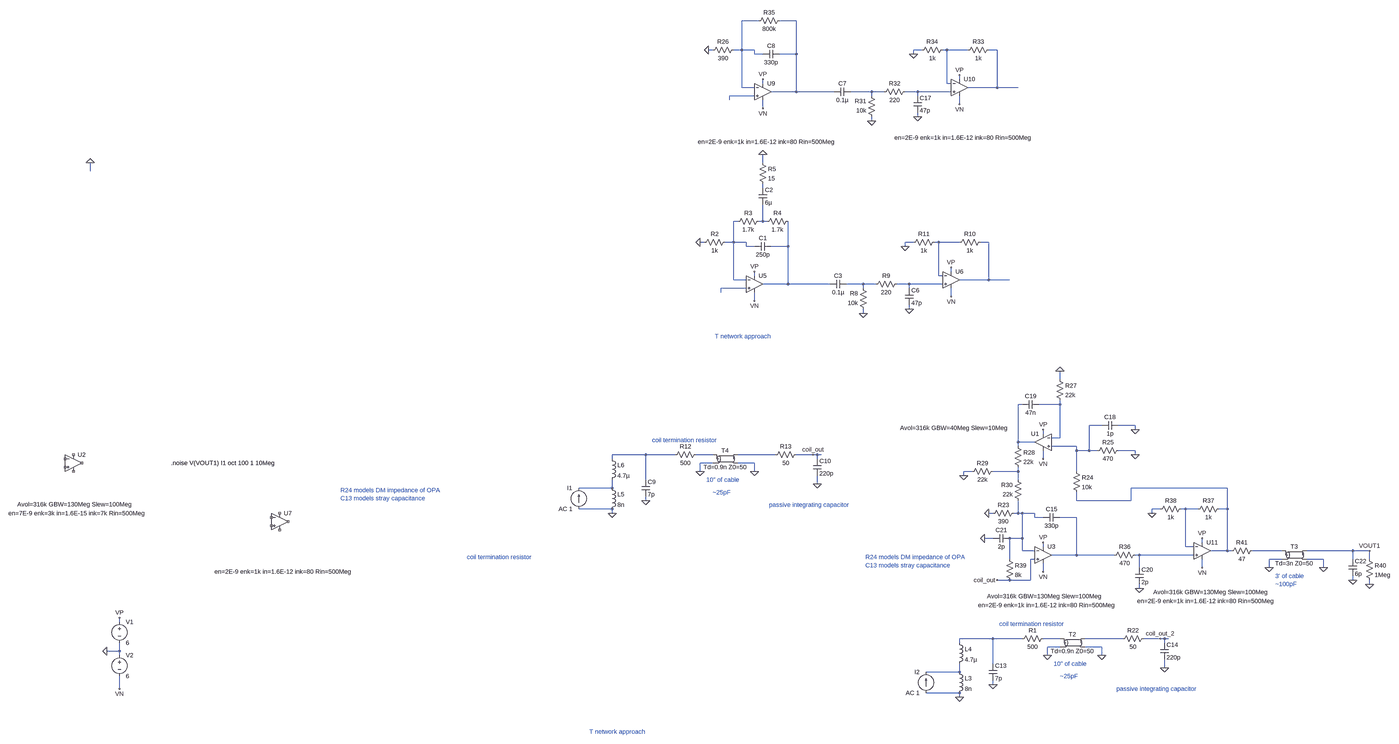
[diagram p0: schematic noise_sim.asc, whole sheet]
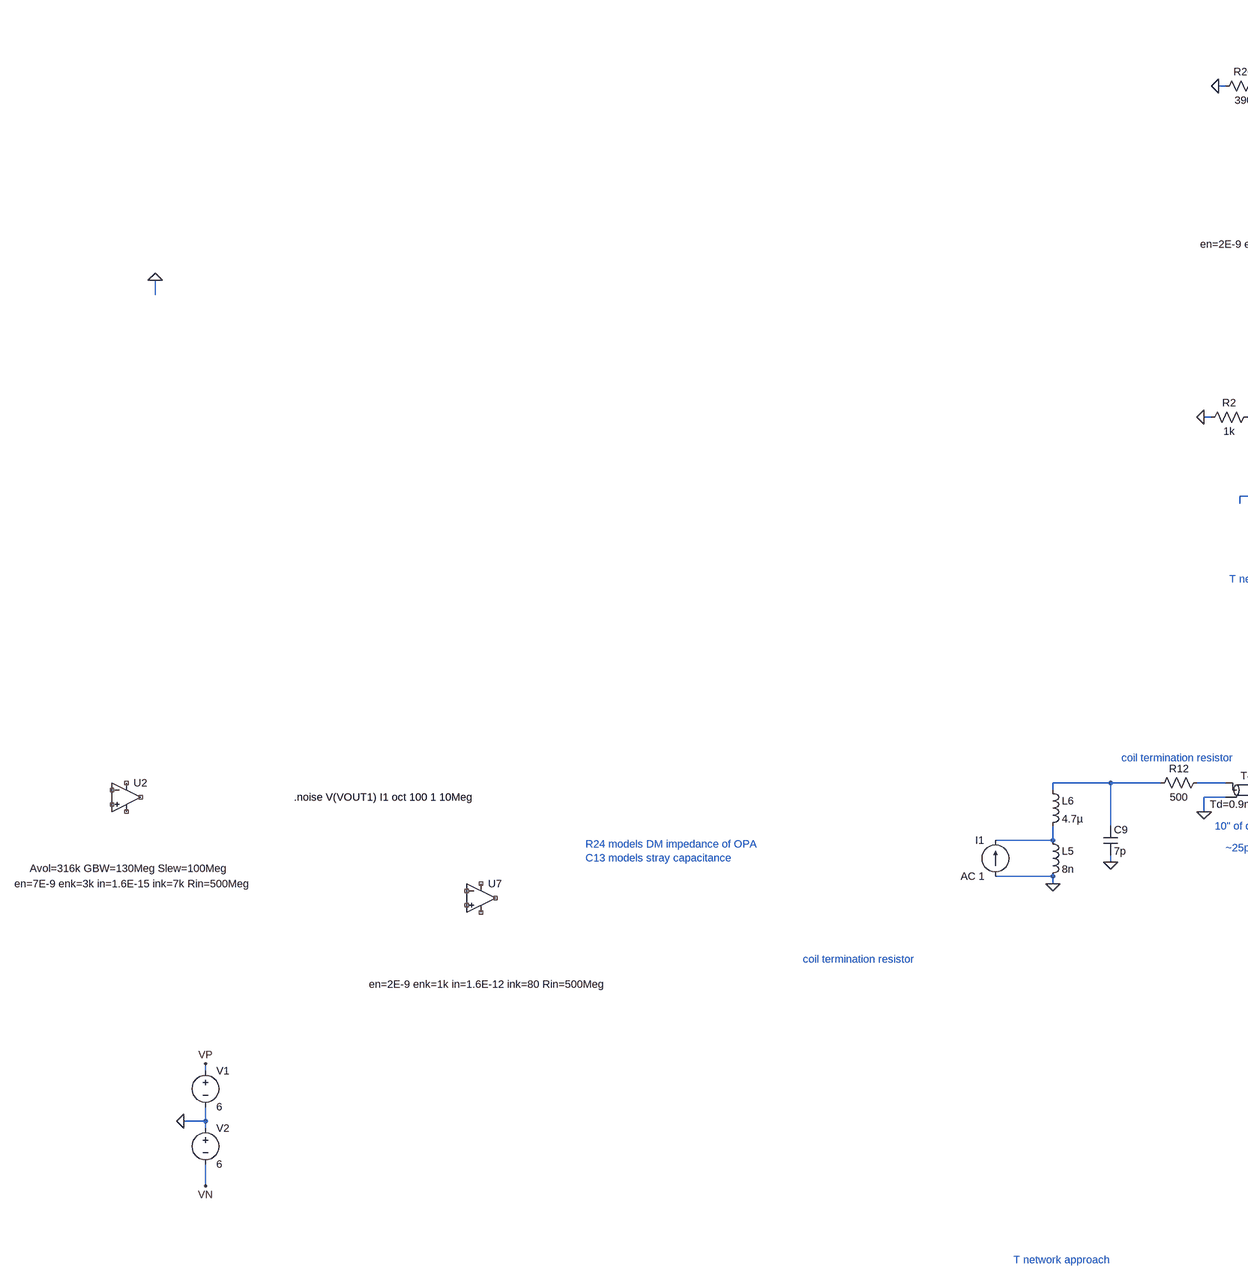
[diagram p1: schematic noise_sim.asc, part, row 1 of 1, column 1 of 2]
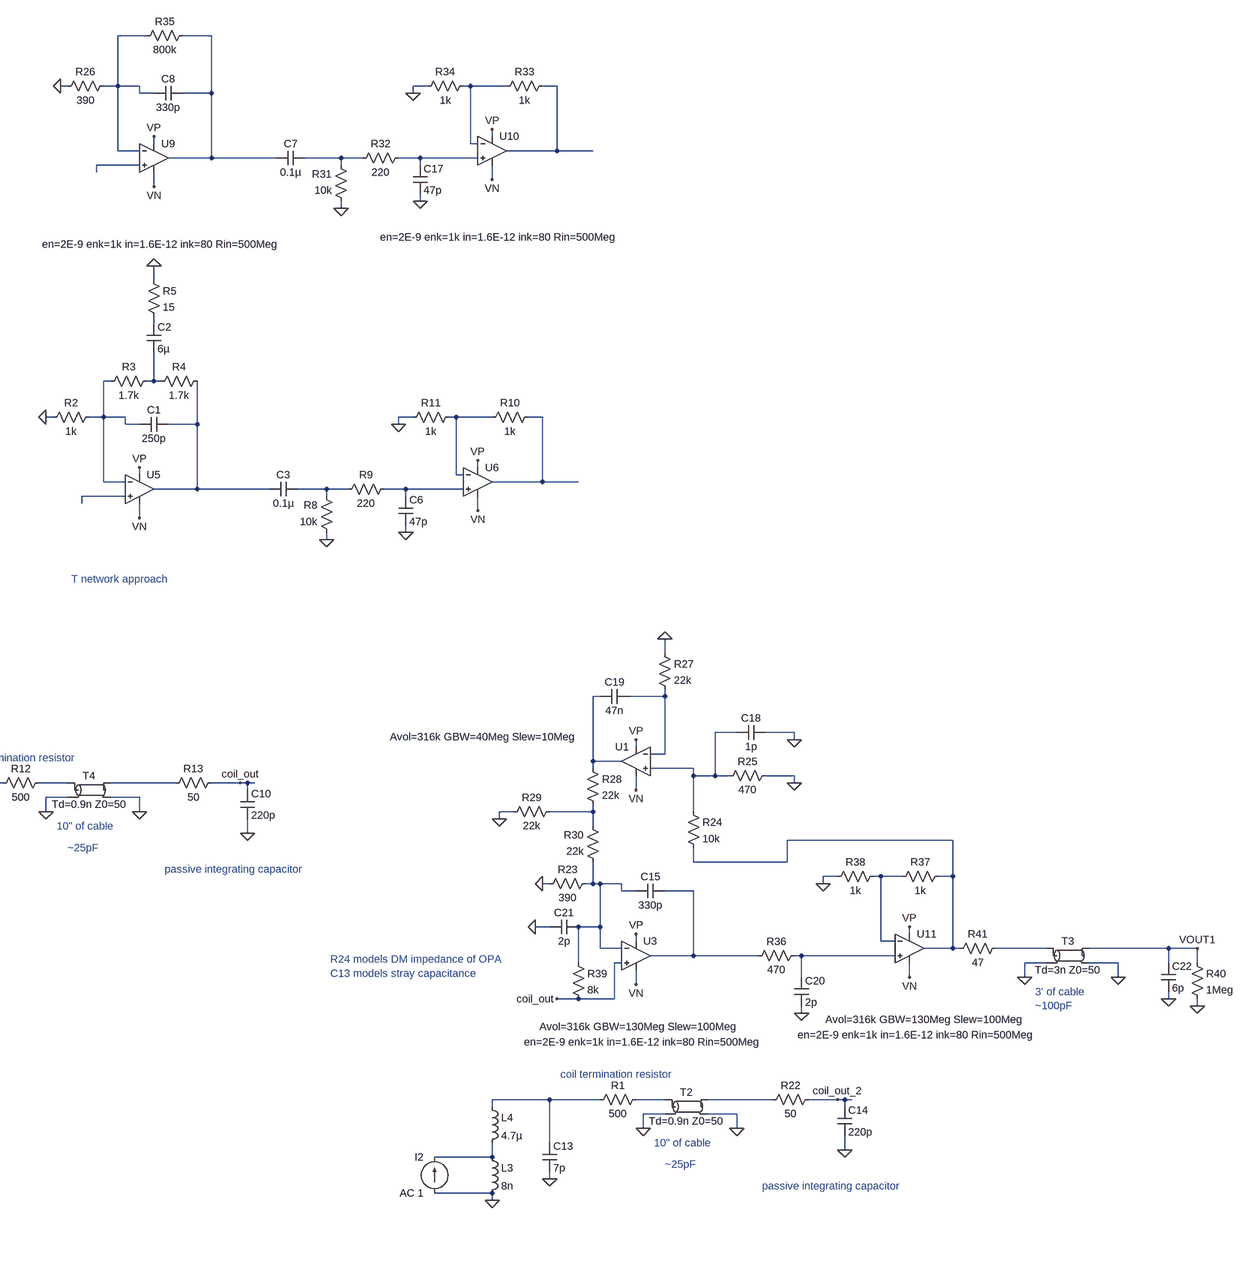
[diagram p2: schematic noise_sim.asc, part, row 1 of 1, column 2 of 2]
noise_sim.asc, the LTspice schematic file:
Version 4
SHEET 1 3200 680
WIRE 768 -3056 704 -3056
WIRE 912 -3056 848 -3056
WIRE 592 -2944 576 -2944
WIRE 704 -2944 704 -3056
WIRE 704 -2944 672 -2944
WIRE 752 -2944 704 -2944
WIRE 1392 -2944 1360 -2944
WIRE 1488 -2944 1472 -2944
WIRE 1568 -2944 1488 -2944
WIRE 1680 -2944 1648 -2944
WIRE 752 -2928 752 -2944
WIRE 784 -2928 752 -2928
WIRE 912 -2928 912 -3056
WIRE 912 -2928 848 -2928
WIRE 1360 -2928 1360 -2944
WIRE 1536 -2832 1536 -2848
WIRE 784 -2816 784 -2832
WIRE 1488 -2816 1488 -2944
WIRE 1504 -2816 1488 -2816
WIRE 704 -2800 704 -2944
WIRE 752 -2800 704 -2800
WIRE 1680 -2800 1680 -2944
WIRE 1680 -2800 1568 -2800
WIRE 1760 -2800 1680 -2800
WIRE 912 -2784 912 -2928
WIRE 912 -2784 816 -2784
WIRE 1056 -2784 912 -2784
WIRE 1200 -2784 1120 -2784
WIRE 1248 -2784 1200 -2784
WIRE 1376 -2784 1328 -2784
WIRE 1504 -2784 1376 -2784
WIRE 752 -2768 656 -2768
WIRE 1200 -2768 1200 -2784
WIRE 1376 -2768 1376 -2784
WIRE 656 -2752 656 -2768
WIRE 1536 -2736 1536 -2768
WIRE 784 -2720 784 -2752
WIRE 1376 -2688 1376 -2704
WIRE 1200 -2672 1200 -2688
WIRE 784 -2512 784 -2544
WIRE -2000 -2480 -2000 -2512
WIRE 784 -2416 784 -2432
WIRE 688 -2288 672 -2288
WIRE 784 -2288 784 -2352
WIRE 784 -2288 768 -2288
WIRE 800 -2288 784 -2288
WIRE 560 -2208 544 -2208
WIRE 672 -2208 672 -2288
WIRE 672 -2208 640 -2208
WIRE 720 -2208 672 -2208
WIRE 1360 -2208 1328 -2208
WIRE 1456 -2208 1440 -2208
WIRE 1536 -2208 1456 -2208
WIRE 1648 -2208 1616 -2208
WIRE 720 -2192 720 -2208
WIRE 752 -2192 720 -2192
WIRE 880 -2192 880 -2288
WIRE 880 -2192 816 -2192
WIRE 1328 -2192 1328 -2208
WIRE 1504 -2096 1504 -2112
WIRE 752 -2080 752 -2096
WIRE 1456 -2080 1456 -2208
WIRE 1472 -2080 1456 -2080
WIRE 672 -2064 672 -2208
WIRE 720 -2064 672 -2064
WIRE 1648 -2064 1648 -2208
WIRE 1648 -2064 1536 -2064
WIRE 1728 -2064 1648 -2064
WIRE 880 -2048 880 -2192
WIRE 880 -2048 784 -2048
WIRE 1040 -2048 880 -2048
WIRE 1168 -2048 1104 -2048
WIRE 1216 -2048 1168 -2048
WIRE 1344 -2048 1296 -2048
WIRE 1472 -2048 1344 -2048
WIRE 720 -2032 624 -2032
WIRE 1168 -2032 1168 -2048
WIRE 1344 -2032 1344 -2048
WIRE 624 -2016 624 -2032
WIRE 1504 -2000 1504 -2032
WIRE 752 -1984 752 -2016
WIRE 1344 -1952 1344 -1968
WIRE 1168 -1936 1168 -1952
WIRE 1920 -1408 1920 -1440
WIRE 1776 -1312 1760 -1312
WIRE 1920 -1312 1920 -1328
WIRE 1920 -1312 1840 -1312
WIRE 2080 -1232 2032 -1232
WIRE 2208 -1232 2144 -1232
WIRE 2208 -1216 2208 -1232
WIRE 1856 -1200 1856 -1216
WIRE 1920 -1184 1920 -1312
WIRE 1920 -1184 1888 -1184
WIRE 1760 -1168 1760 -1312
WIRE 1824 -1168 1760 -1168
WIRE 1760 -1152 1760 -1168
WIRE 1984 -1152 1888 -1152
WIRE 1984 -1136 1984 -1152
WIRE 2032 -1136 2032 -1232
WIRE 2032 -1136 1984 -1136
WIRE 2064 -1136 2032 -1136
WIRE 2208 -1136 2144 -1136
WIRE 336 -1120 208 -1120
WIRE 448 -1120 336 -1120
WIRE 592 -1120 528 -1120
WIRE 832 -1120 688 -1120
WIRE 976 -1120 912 -1120
WIRE 992 -1120 976 -1120
WIRE 1008 -1120 992 -1120
WIRE 2208 -1120 2208 -1136
WIRE 208 -1104 208 -1120
WIRE 992 -1104 992 -1120
WIRE 1856 -1104 1856 -1136
WIRE 592 -1088 544 -1088
WIRE 752 -1088 688 -1088
WIRE 544 -1056 544 -1088
WIRE 752 -1056 752 -1088
WIRE 1584 -1056 1552 -1056
WIRE 1760 -1056 1760 -1072
WIRE 1760 -1056 1664 -1056
WIRE 1984 -1056 1984 -1136
WIRE 1552 -1040 1552 -1056
WIRE 336 -1024 336 -1120
WIRE 1760 -1024 1760 -1056
WIRE 992 -1008 992 -1040
WIRE 208 -992 208 -1024
WIRE 208 -992 80 -992
WIRE 2560 -992 2192 -992
WIRE 336 -944 336 -960
WIRE 1984 -944 1984 -976
WIRE 2192 -944 2192 -992
WIRE 2192 -944 1984 -944
WIRE 208 -912 80 -912
WIRE 2304 -912 2272 -912
WIRE 2400 -912 2384 -912
WIRE 2448 -912 2400 -912
WIRE 2560 -912 2560 -992
WIRE 2560 -912 2528 -912
WIRE 208 -896 208 -912
WIRE 1664 -896 1648 -896
WIRE 1760 -896 1760 -944
WIRE 1760 -896 1744 -896
WIRE 1776 -896 1760 -896
WIRE 1824 -896 1776 -896
WIRE 2272 -896 2272 -912
WIRE 1824 -880 1824 -896
WIRE 1856 -880 1824 -880
WIRE 1984 -880 1920 -880
WIRE 1664 -800 1632 -800
WIRE 1776 -800 1776 -896
WIRE 1776 -800 1728 -800
WIRE 2464 -784 2464 -800
WIRE 1856 -768 1856 -784
WIRE 2400 -768 2400 -912
WIRE 2432 -768 2400 -768
WIRE 1776 -752 1776 -800
WIRE 1824 -752 1776 -752
WIRE 2560 -752 2560 -912
WIRE 2560 -752 2496 -752
WIRE 2576 -752 2560 -752
WIRE 2768 -752 2656 -752
WIRE 3040 -752 2864 -752
WIRE 3104 -752 3040 -752
WIRE 1984 -736 1984 -880
WIRE 1984 -736 1888 -736
WIRE 2128 -736 1984 -736
WIRE 2224 -736 2208 -736
WIRE 2432 -736 2224 -736
WIRE 1728 -720 1728 -800
WIRE 1824 -720 1808 -720
WIRE 2768 -720 2720 -720
WIRE 2928 -720 2864 -720
WIRE 3040 -720 3040 -752
WIRE 3104 -720 3104 -752
WIRE 2224 -688 2224 -736
WIRE 2464 -688 2464 -720
WIRE 2720 -688 2720 -720
WIRE 2928 -688 2928 -720
WIRE 1856 -672 1856 -704
WIRE 1728 -640 1680 -640
WIRE 1808 -640 1808 -720
WIRE 1808 -640 1728 -640
WIRE 3040 -640 3040 -656
WIRE 3104 -624 3104 -640
WIRE 2224 -608 2224 -624
WIRE -1888 -480 -1888 -496
WIRE 1664 -416 1536 -416
WIRE 1776 -416 1664 -416
WIRE 1920 -416 1856 -416
WIRE 2160 -416 2016 -416
WIRE 2304 -416 2240 -416
WIRE 2320 -416 2304 -416
WIRE 2336 -416 2320 -416
WIRE 1536 -400 1536 -416
WIRE 2320 -400 2320 -416
WIRE 1920 -384 1872 -384
WIRE 2080 -384 2016 -384
WIRE -1888 -368 -1888 -400
WIRE -1888 -368 -1936 -368
WIRE -1888 -352 -1888 -368
WIRE 1872 -352 1872 -384
WIRE 2080 -352 2080 -384
WIRE 1664 -320 1664 -416
WIRE 2320 -304 2320 -336
WIRE 1536 -288 1536 -320
WIRE 1536 -288 1408 -288
WIRE 1664 -240 1664 -256
WIRE -1888 -224 -1888 -272
WIRE 1536 -208 1408 -208
WIRE 1536 -192 1536 -208
FLAG -1936 -368 0
FLAG -1888 -496 VP
FLAG -1888 -224 VN
FLAG -2000 -2512 0
FLAG 752 -2096 VP
FLAG 752 -1984 VN
FLAG 544 -2208 0
FLAG 784 -2544 0
FLAG 1344 -1952 0
FLAG 1168 -1936 0
FLAG 1504 -2112 VP
FLAG 1504 -2000 VN
FLAG 1328 -2192 0
FLAG 784 -2832 VP
FLAG 784 -2720 VN
FLAG 576 -2944 0
FLAG 1376 -2688 0
FLAG 1200 -2672 0
FLAG 1536 -2848 VP
FLAG 1536 -2736 VN
FLAG 1360 -2928 0
FLAG 1680 -640 coil_out
FLAG 1664 -240 0
FLAG 1536 -192 0
FLAG 1872 -352 0
FLAG 2080 -352 0
FLAG 2320 -304 0
FLAG 2304 -416 coil_out_2
FLAG 1856 -784 VP
FLAG 1856 -672 VN
FLAG 1648 -896 0
FLAG 1856 -1216 VP
FLAG 1856 -1104 VN
FLAG 2208 -1120 0
FLAG 2208 -1216 0
FLAG 1920 -1440 0
FLAG 1552 -1040 0
FLAG 2464 -800 VP
FLAG 2464 -688 VN
FLAG 2224 -608 0
FLAG 2272 -896 0
FLAG 1632 -800 0
FLAG 2720 -688 0
FLAG 2928 -688 0
FLAG 3040 -640 0
FLAG 3104 -624 0
FLAG 3104 -752 VOUT1
FLAG 336 -944 0
FLAG 208 -896 0
FLAG 544 -1056 0
FLAG 752 -1056 0
FLAG 992 -1008 0
FLAG 976 -1120 coil_out
SYMBOL voltage -1888 -496 R0
WINDOW 123 0 0 Left 0
WINDOW 39 0 0 Left 0
SYMATTR InstName V1
SYMATTR Value 6
SYMBOL voltage -1888 -368 R0
WINDOW 123 0 0 Left 0
WINDOW 39 0 0 Left 0
SYMATTR InstName V2
SYMATTR Value 6
SYMBOL res 544 -2192 R270
WINDOW 0 32 56 VTop 2
WINDOW 3 0 56 VBottom 2
SYMATTR InstName R2
SYMATTR Value 1k
SYMBOL cap 816 -2208 R90
WINDOW 0 0 32 VBottom 2
WINDOW 3 32 32 VTop 2
SYMATTR InstName C1
SYMATTR Value 250p
SYMBOL res 784 -2304 R90
WINDOW 0 0 56 VBottom 2
WINDOW 3 32 56 VTop 2
SYMATTR InstName R3
SYMATTR Value 1.7k
SYMBOL res 896 -2304 R90
WINDOW 0 0 56 VBottom 2
WINDOW 3 32 56 VTop 2
SYMATTR InstName R4
SYMATTR Value 1.7k
SYMBOL cap 768 -2416 R0
SYMATTR InstName C2
SYMATTR Value 6µ
SYMBOL res 768 -2528 R0
SYMATTR InstName R5
SYMATTR Value 15
SYMBOL res 1184 -1936 R180
WINDOW 0 36 76 Left 2
WINDOW 3 36 40 Left 2
SYMATTR InstName R8
SYMATTR Value 10k
SYMBOL cap 1104 -2064 R90
WINDOW 0 0 32 VBottom 2
WINDOW 3 32 32 VTop 2
SYMATTR InstName C3
SYMATTR Value 0.1µ
SYMBOL res 1312 -2064 R90
WINDOW 0 0 56 VBottom 2
WINDOW 3 32 56 VTop 2
SYMATTR InstName R9
SYMATTR Value 220
SYMBOL cap 1328 -2032 R0
SYMATTR InstName C6
SYMATTR Value 47p
SYMBOL res 1632 -2224 R90
WINDOW 0 0 56 VBottom 2
WINDOW 3 32 56 VTop 2
SYMATTR InstName R10
SYMATTR Value 1k
SYMBOL res 1456 -2224 R90
WINDOW 0 0 56 VBottom 2
WINDOW 3 32 56 VTop 2
SYMATTR InstName R11
SYMATTR Value 1k
SYMBOL OpAmps\\UniversalOpamp2 752 -2048 R0
SYMATTR InstName U5
SYMATTR Value2 Avol=316k GBW=50Meg Slew=100Meg
SYMATTR SpiceLine2 en=6E-9 enk=25 in=0.4E-12 ink=2k Rin=500Meg
SYMBOL OpAmps\\UniversalOpamp2 1504 -2064 R0
SYMATTR InstName U6
SYMATTR Value2 Avol=316k GBW=50Meg Slew=100Meg
SYMATTR SpiceLine2 en=6E-9 enk=25 in=0.4E-12 ink=2k Rin=500Meg
SYMBOL res 576 -2928 R270
WINDOW 0 32 56 VTop 2
WINDOW 3 0 56 VBottom 2
SYMATTR InstName R26
SYMATTR Value 390
SYMBOL cap 848 -2944 R90
WINDOW 0 0 32 VBottom 2
WINDOW 3 32 32 VTop 2
SYMATTR InstName C8
SYMATTR Value 330p
SYMBOL res 1216 -2672 R180
WINDOW 0 36 76 Left 2
WINDOW 3 36 40 Left 2
SYMATTR InstName R31
SYMATTR Value 10k
SYMBOL res 1344 -2800 R90
WINDOW 0 0 56 VBottom 2
WINDOW 3 32 56 VTop 2
SYMATTR InstName R32
SYMATTR Value 220
SYMBOL cap 1360 -2768 R0
SYMATTR InstName C17
SYMATTR Value 47p
SYMBOL res 1664 -2960 R90
WINDOW 0 0 56 VBottom 2
WINDOW 3 32 56 VTop 2
SYMATTR InstName R33
SYMATTR Value 1k
SYMBOL res 1488 -2960 R90
WINDOW 0 0 56 VBottom 2
WINDOW 3 32 56 VTop 2
SYMATTR InstName R34
SYMATTR Value 1k
SYMBOL res 864 -3072 R90
WINDOW 0 0 56 VBottom 2
WINDOW 3 32 56 VTop 2
SYMATTR InstName R35
SYMATTR Value 800k
SYMBOL OpAmps\\UniversalOpamp2 -1232 -864 R0
WINDOW 40 -249 192 Left 2
SYMATTR SpiceLine2 en=2E-9 enk=1k in=1.6E-12 ink=80 Rin=500Meg
SYMATTR InstName U7
SYMATTR Value2 Avol=316k GBW=130Meg Slew=100Meg
SYMATTR SpiceLine ilimit=80m rail=0 Vos=0 phimargin=45
SYMBOL OpAmps\\UniversalOpamp2 -2064 -1088 R0
WINDOW 123 -215 158 Left 2
WINDOW 40 -249 192 Left 2
SYMATTR Value2 Avol=316k GBW=130Meg Slew=100Meg
SYMATTR SpiceLine2 en=7E-9 enk=3k in=1.6E-15 ink=7k Rin=500Meg
SYMATTR InstName U2
SYMATTR SpiceLine ilimit=80m rail=0 Vos=0 phimargin=45
SYMBOL ind 1520 -304 R0
SYMATTR InstName L3
SYMATTR Value 8n
SYMATTR SpiceLine Rser=0
SYMBOL ind 1520 -416 R0
SYMATTR InstName L4
SYMATTR Value 4.7µ
SYMBOL cap 1648 -320 R0
SYMATTR InstName C13
SYMATTR Value 7p
SYMBOL res 1872 -432 R90
WINDOW 0 0 56 VBottom 2
WINDOW 3 32 56 VTop 2
SYMATTR InstName R1
SYMATTR Value 500
SYMBOL res 2256 -432 R90
WINDOW 0 0 56 VBottom 2
WINDOW 3 32 56 VTop 2
SYMATTR InstName R22
SYMATTR Value 50
SYMBOL tline 1968 -400 R0
SYMATTR InstName T2
SYMATTR Value Td=0.9n Z0=50
SYMBOL cap 2304 -400 R0
SYMATTR InstName C14
SYMATTR Value 220p
SYMBOL res 1648 -880 R270
WINDOW 0 32 56 VTop 2
WINDOW 3 0 56 VBottom 2
SYMATTR InstName R23
SYMATTR Value 390
SYMBOL cap 1920 -896 R90
WINDOW 0 0 32 VBottom 2
WINDOW 3 32 32 VTop 2
SYMATTR InstName C15
SYMATTR Value 330p
SYMBOL res 1968 -1072 R0
SYMATTR InstName R24
SYMATTR Value 10k
SYMBOL res 2160 -1152 R90
WINDOW 0 0 56 VBottom 2
WINDOW 3 32 56 VTop 2
SYMATTR InstName R25
SYMATTR Value 470
SYMBOL cap 2144 -1248 R90
WINDOW 0 0 32 VBottom 2
WINDOW 3 32 32 VTop 2
SYMATTR InstName C18
SYMATTR Value 1p
SYMBOL res 1904 -1424 R0
SYMATTR InstName R27
SYMATTR Value 22k
SYMBOL cap 1840 -1328 R90
WINDOW 0 0 32 VBottom 2
WINDOW 3 32 32 VTop 2
SYMATTR InstName C19
SYMATTR Value 47n
SYMBOL res 1744 -1168 R0
SYMATTR InstName R28
SYMATTR Value 22k
SYMBOL res 1680 -1072 R90
WINDOW 0 0 56 VBottom 2
WINDOW 3 32 56 VTop 2
SYMATTR InstName R29
SYMATTR Value 22k
SYMBOL res 1776 -928 R180
WINDOW 0 36 76 Left 2
WINDOW 3 36 40 Left 2
SYMATTR InstName R30
SYMATTR Value 22k
SYMBOL res 2224 -752 R90
WINDOW 0 0 56 VBottom 2
WINDOW 3 32 56 VTop 2
SYMATTR InstName R36
SYMATTR Value 470
SYMBOL cap 2208 -688 R0
SYMATTR InstName C20
SYMATTR Value 2p
SYMBOL res 2544 -928 R90
WINDOW 0 0 56 VBottom 2
WINDOW 3 32 56 VTop 2
SYMATTR InstName R37
SYMATTR Value 1k
SYMBOL res 2400 -928 R90
WINDOW 0 0 56 VBottom 2
WINDOW 3 32 56 VTop 2
SYMATTR InstName R38
SYMATTR Value 1k
SYMBOL OpAmps\\UniversalOpamp2 1856 -1168 M0
WINDOW 123 135 -54 Left 2
SYMATTR Value2 Avol=316k GBW=40Meg Slew=10Meg
SYMATTR InstName U1
SYMATTR SpiceLine2 en=1E-9 enk=25 in=0.04E-12 ink=2k Rin=500Meg
SYMBOL cap 1728 -816 R90
WINDOW 0 0 32 VBottom 2
WINDOW 3 32 32 VTop 2
SYMATTR InstName C21
SYMATTR Value 2p
SYMBOL res 1712 -736 R0
SYMATTR InstName R39
SYMATTR Value 8k
SYMBOL OpAmps\\UniversalOpamp2 1856 -736 R0
WINDOW 123 -215 158 Left 2
WINDOW 40 -249 192 Left 2
SYMATTR Value2 Avol=316k GBW=130Meg Slew=100Meg
SYMATTR SpiceLine2 en=2E-9 enk=1k in=1.6E-12 ink=80 Rin=500Meg
SYMATTR InstName U3
SYMATTR SpiceLine ilimit=80m rail=0 Vos=0 phimargin=45
SYMBOL tline 2816 -736 R0
SYMATTR InstName T3
SYMATTR Value Td=3n Z0=50
SYMBOL res 3088 -736 R0
SYMATTR InstName R40
SYMATTR Value 1Meg
SYMBOL cap 3024 -720 R0
SYMATTR InstName C22
SYMATTR Value 6p
SYMBOL res 2672 -768 R90
WINDOW 0 0 56 VBottom 2
WINDOW 3 32 56 VTop 2
SYMATTR InstName R41
SYMATTR Value 47
SYMBOL OpAmps\\UniversalOpamp2 2464 -752 R0
WINDOW 123 -187 158 Left 2
WINDOW 40 -249 192 Left 2
SYMATTR Value2 Avol=316k GBW=130Meg Slew=100Meg
SYMATTR SpiceLine2 en=2E-9 enk=1k in=1.6E-12 ink=80 Rin=500Meg
SYMATTR InstName U11
SYMATTR SpiceLine ilimit=80m rail=0 Vos=0 phimargin=45
SYMBOL current 1408 -208 R180
WINDOW 0 24 80 Left 2
WINDOW 3 24 0 Left 2
WINDOW 123 0 0 Left 0
WINDOW 39 0 0 Left 0
SYMATTR InstName I2
SYMATTR Value AC 1
SYMBOL OpAmps\\UniversalOpamp2 784 -2784 R0
WINDOW 40 -249 192 Left 2
SYMATTR SpiceLine2 en=2E-9 enk=1k in=1.6E-12 ink=80 Rin=500Meg
SYMATTR InstName U9
SYMATTR Value2 Avol=316k GBW=130Meg Slew=100Meg
SYMATTR SpiceLine ilimit=80m rail=0 Vos=0 phimargin=45
SYMBOL OpAmps\\UniversalOpamp2 1536 -2800 R0
WINDOW 40 -249 192 Left 2
SYMATTR SpiceLine2 en=2E-9 enk=1k in=1.6E-12 ink=80 Rin=500Meg
SYMATTR InstName U10
SYMATTR Value2 Avol=316k GBW=130Meg Slew=100Meg
SYMATTR SpiceLine ilimit=80m rail=0 Vos=0 phimargin=45
SYMBOL cap 1120 -2800 R90
WINDOW 0 0 32 VBottom 2
WINDOW 3 32 32 VTop 2
SYMATTR InstName C7
SYMATTR Value 0.1µ
SYMBOL ind 192 -1008 R0
SYMATTR InstName L5
SYMATTR Value 8n
SYMATTR SpiceLine Rser=0
SYMBOL ind 192 -1120 R0
SYMATTR InstName L6
SYMATTR Value 4.7µ
SYMBOL cap 320 -1024 R0
SYMATTR InstName C9
SYMATTR Value 7p
SYMBOL res 544 -1136 R90
WINDOW 0 0 56 VBottom 2
WINDOW 3 32 56 VTop 2
SYMATTR InstName R12
SYMATTR Value 500
SYMBOL res 928 -1136 R90
WINDOW 0 0 56 VBottom 2
WINDOW 3 32 56 VTop 2
SYMATTR InstName R13
SYMATTR Value 50
SYMBOL tline 640 -1104 R0
SYMATTR InstName T4
SYMATTR Value Td=0.9n Z0=50
SYMBOL cap 976 -1104 R0
SYMATTR InstName C10
SYMATTR Value 220p
SYMBOL current 80 -912 R180
WINDOW 0 24 80 Left 2
WINDOW 3 24 0 Left 2
WINDOW 123 0 0 Left 0
WINDOW 39 0 0 Left 0
SYMATTR InstName I1
SYMATTR Value AC 1
TEXT -488 -728 Left 2 ;coil termination resistor
TEXT 120 232 Left 2 ;T network approach
TEXT -1648 -1088 Left 2 !.noise V(VOUT1) I1 oct 100 1 10Meg
TEXT 600 -1848 Left 2 ;T network approach
TEXT -1000 -984 Left 2 ;R24 models DM impedance of OPA\nC13 models stray capacitance
TEXT 1896 -320 Left 2 ;10" of cable
TEXT 1688 -472 Left 2 ;coil termination resistor
TEXT 2136 -224 Left 2 ;passive integrating capacitor
TEXT 1920 -272 Left 2 ;~25pF
TEXT 1176 -728 Left 2 ;R24 models DM impedance of OPA\nC13 models stray capacitance
TEXT 2744 -656 Left 2 ;3' of cable\n~100pF
TEXT 568 -1024 Left 2 ;10" of cable
TEXT 360 -1176 Left 2 ;coil termination resistor
TEXT 808 -928 Left 2 ;passive integrating capacitor
TEXT 592 -976 Left 2 ;~25pF

The netlist it stands for:
* noise_sim.asc
V1 VP 0 6
V2 0 VN 6
R2 0 N009 1k
C1 N013 N009 250p
R3 N010 N009 1.7k
R4 N013 N010 1.7k
C2 N008 N010 6µ
R5 0 N008 15
R8 0 N014 10k
C3 N014 N013 0.1µ
R9 N015 N014 220
C6 N015 0 47p
R10 N012 N011 1k
R11 N011 0 1k
XU5 N016 N009 VP VN N013 level.2 Avol=316k GBW=50Meg Slew=100Meg ilimit=25m rail=0 Vos=0 phimargin=45 en=6E-9 enk=25 in=0.4E-12 ink=2k Rin=500Meg  ; pins IN+ IN- V+ V- OUT
XU6 N015 N011 VP VN N012 level.2 Avol=316k GBW=50Meg Slew=100Meg ilimit=25m rail=0 Vos=0 phimargin=45 en=6E-9 enk=25 in=0.4E-12 ink=2k Rin=500Meg  ; pins IN+ IN- V+ V- OUT
R26 0 N001 390
C8 N002 N001 330p
R31 0 N005 10k
R32 N006 N005 220
C17 N006 0 47p
R33 N004 N003 1k
R34 N003 0 1k
R35 N002 N001 800k
XU7 NC_01 NC_02 NC_03 NC_04 NC_05 level.2 Avol=316k GBW=130Meg Slew=100Meg ilimit=80m rail=0 Vos=0 phimargin=45 en=2E-9 enk=1k in=1.6E-12 ink=80 Rin=500Meg  ; pins IN+ IN- V+ V- OUT
XU2 NC_06 NC_07 NC_08 NC_09 NC_10 level.2 Avol=316k GBW=130Meg Slew=100Meg ilimit=80m rail=0 Vos=0 phimargin=45 en=7E-9 enk=3k in=1.6E-15 ink=7k Rin=500Meg  ; pins IN+ IN- V+ V- OUT
L3 N034 0 8n Rser=0
L4 N031 N034 4.7µ
C13 N031 0 7p
R1 N032 N031 500
R22 coil_out_2 N033 50
T2 N032 0 N033 0 Td=0.9n Z0=50
C14 coil_out_2 0 220p
R23 0 N027 390
C15 N028 N027 330p
R24 N019 N025 10k
R25 0 N019 470
C18 0 N019 1p
R27 0 N018 22k
C19 N018 N017 47n
R28 N017 N023 22k
R29 N023 0 22k
R30 N027 N023 22k
R36 N030 N028 470
C20 N030 0 2p
R37 N025 N026 1k
R38 N026 0 1k
XU1 N019 N018 VP VN N017 level.2 Avol=316k GBW=40Meg Slew=10Meg ilimit=25m rail=0 Vos=0 phimargin=45 en=1E-9 enk=25 in=0.04E-12 ink=2k Rin=500Meg  ; pins IN+ IN- V+ V- OUT
C21 N027 0 2p
R39 N027 coil_out 8k
XU3 coil_out N027 VP VN N028 level.2 Avol=316k GBW=130Meg Slew=100Meg ilimit=80m rail=0 Vos=0 phimargin=45 en=2E-9 enk=1k in=1.6E-12 ink=80 Rin=500Meg  ; pins IN+ IN- V+ V- OUT
T3 N029 0 VOUT1 0 Td=3n Z0=50
R40 VOUT1 0 1Meg
C22 VOUT1 0 6p
R41 N029 N025 47
XU11 N030 N026 VP VN N025 level.2 Avol=316k GBW=130Meg Slew=100Meg ilimit=80m rail=0 Vos=0 phimargin=45 en=2E-9 enk=1k in=1.6E-12 ink=80 Rin=500Meg  ; pins IN+ IN- V+ V- OUT
I2 0 N034 AC 1
XU9 N007 N001 VP VN N002 level.2 Avol=316k GBW=130Meg Slew=100Meg ilimit=80m rail=0 Vos=0 phimargin=45 en=2E-9 enk=1k in=1.6E-12 ink=80 Rin=500Meg  ; pins IN+ IN- V+ V- OUT
XU10 N006 N003 VP VN N004 level.2 Avol=316k GBW=130Meg Slew=100Meg ilimit=80m rail=0 Vos=0 phimargin=45 en=2E-9 enk=1k in=1.6E-12 ink=80 Rin=500Meg  ; pins IN+ IN- V+ V- OUT
C7 N005 N002 0.1µ
L5 N024 0 8n Rser=0
L6 N020 N024 4.7µ
C9 N020 0 7p
R12 N021 N020 500
R13 coil_out N022 50
T4 N021 0 N022 0 Td=0.9n Z0=50
C10 coil_out 0 220p
I1 0 N024 AC 1
* coil termination resistor
* T network approach
.noise V(VOUT1) I1 oct 100 1 10Meg
* T network approach
* R24 models DM impedance of OPA
* C13 models stray capacitance
* 10" of cable
* coil termination resistor
* passive integrating capacitor
* ~25pF
* R24 models DM impedance of OPA
* C13 models stray capacitance
* 3' of cable
* ~100pF
* 10" of cable
* coil termination resistor
* passive integrating capacitor
* ~25pF
.lib UniversalOpamps2.sub
.backanno
.end